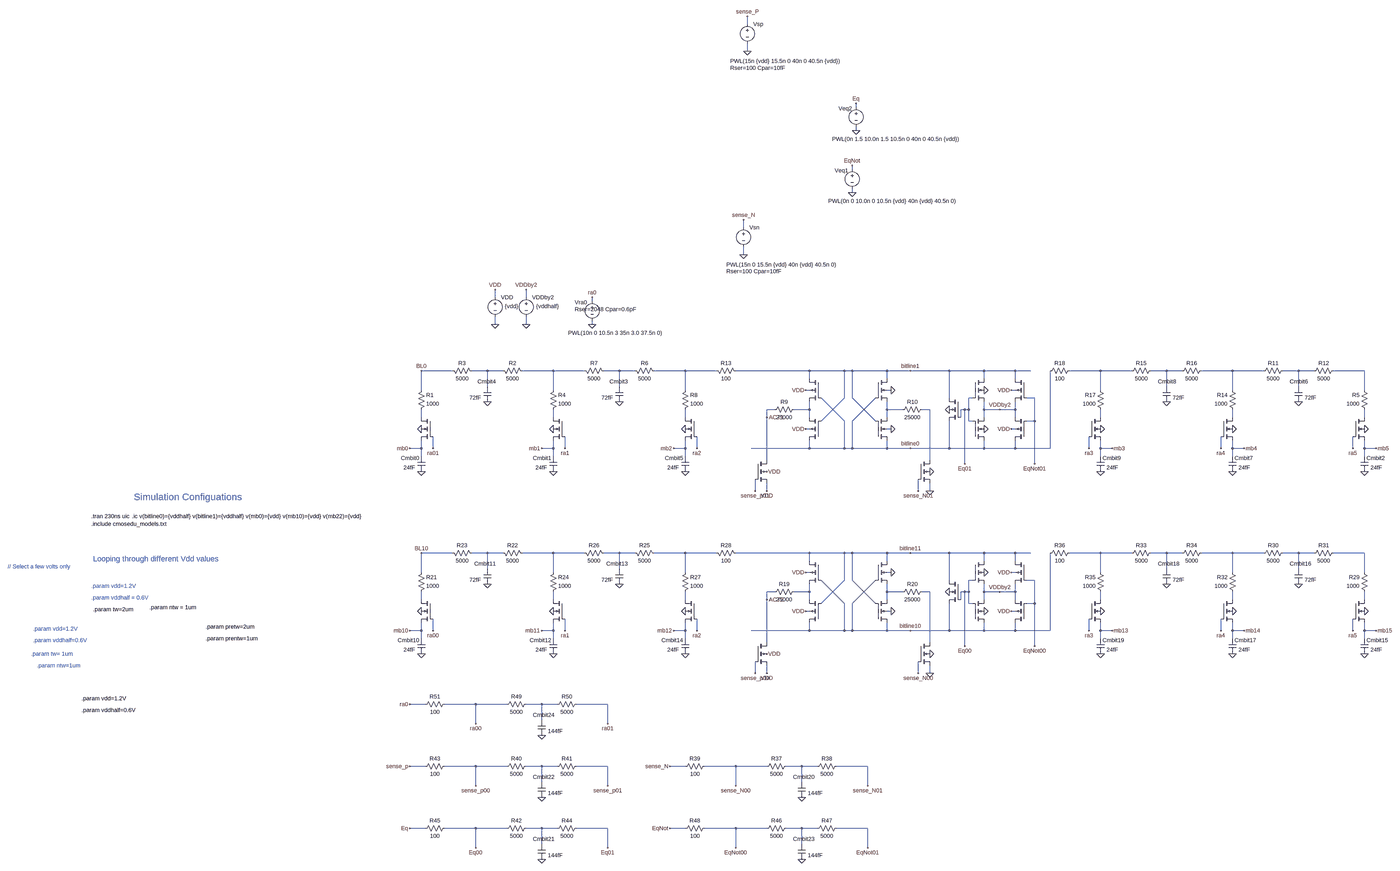
[diagram p0: schematic diva-dram_wordline.asc, whole sheet]
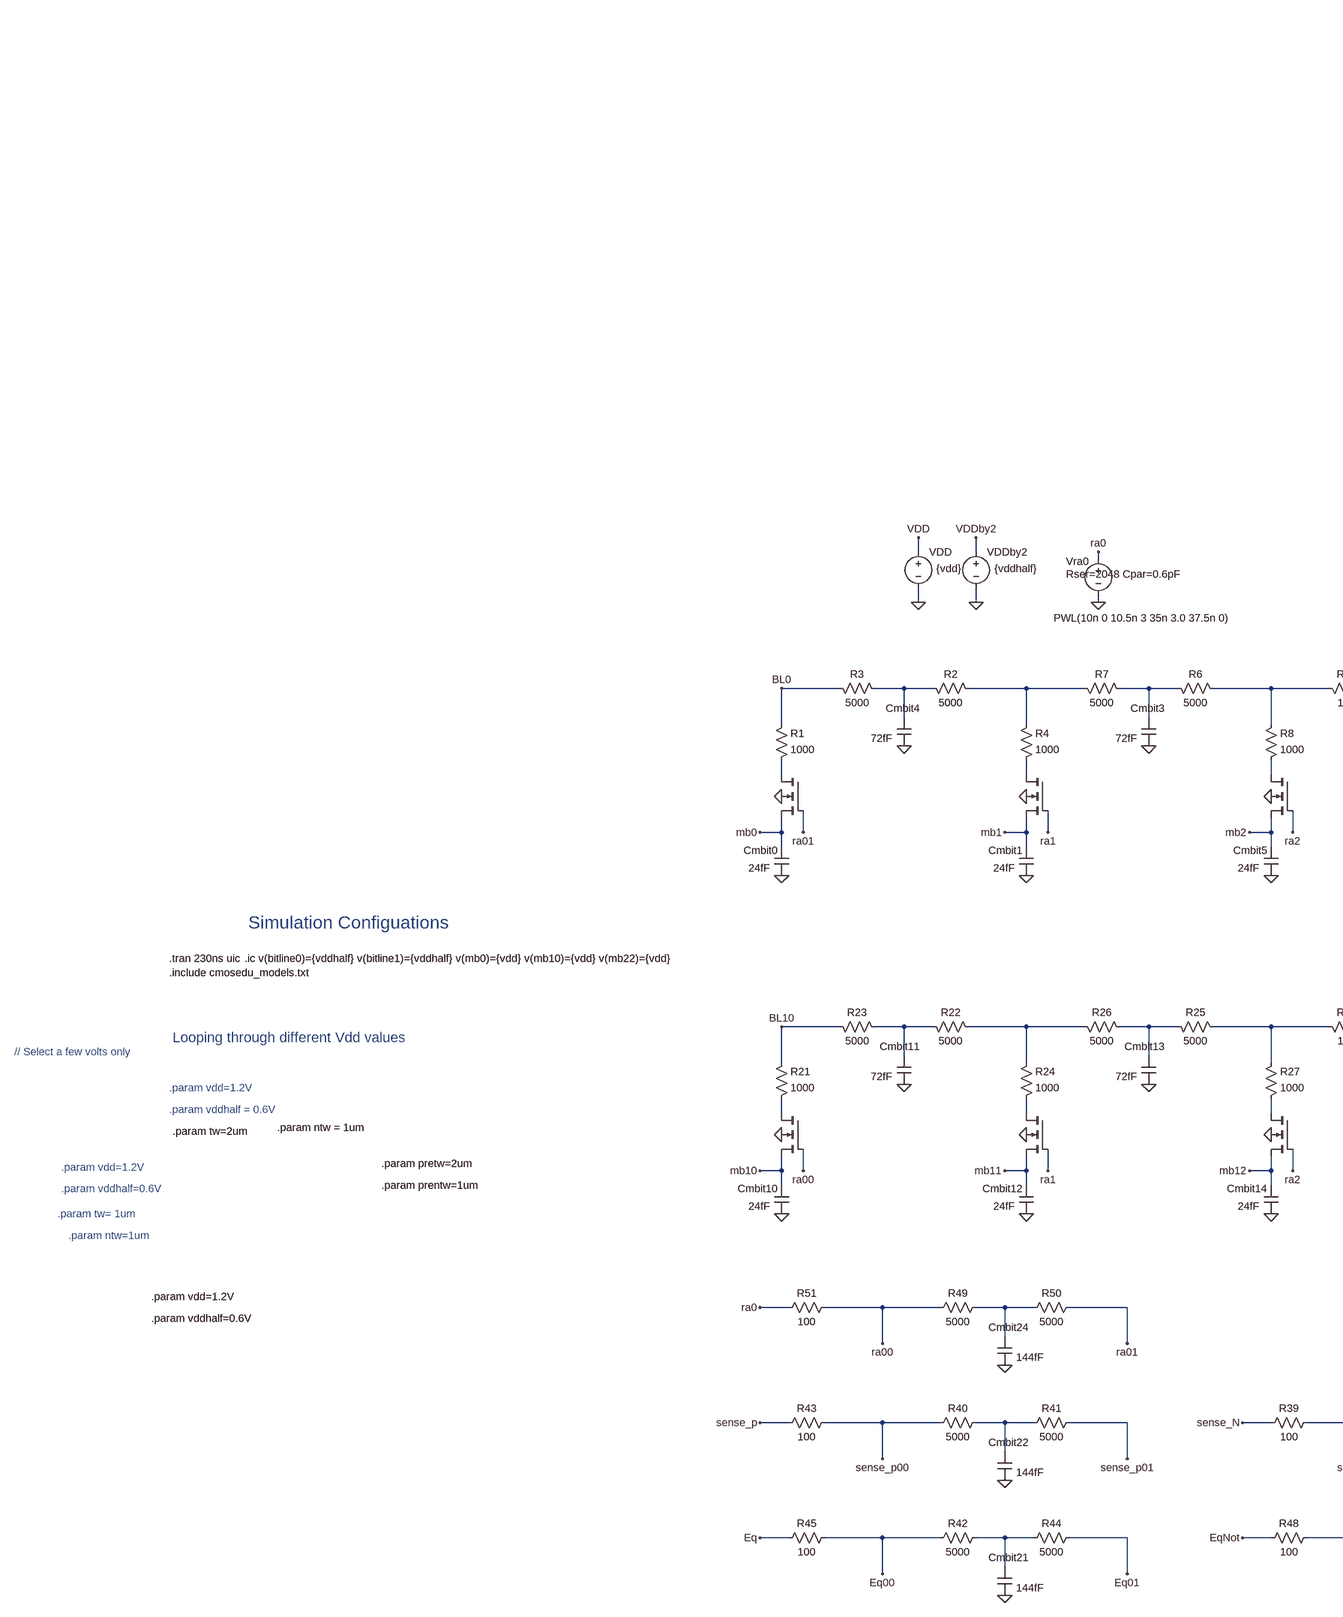
[diagram p1: schematic diva-dram_wordline.asc, part, row 1 of 1, column 1 of 2]
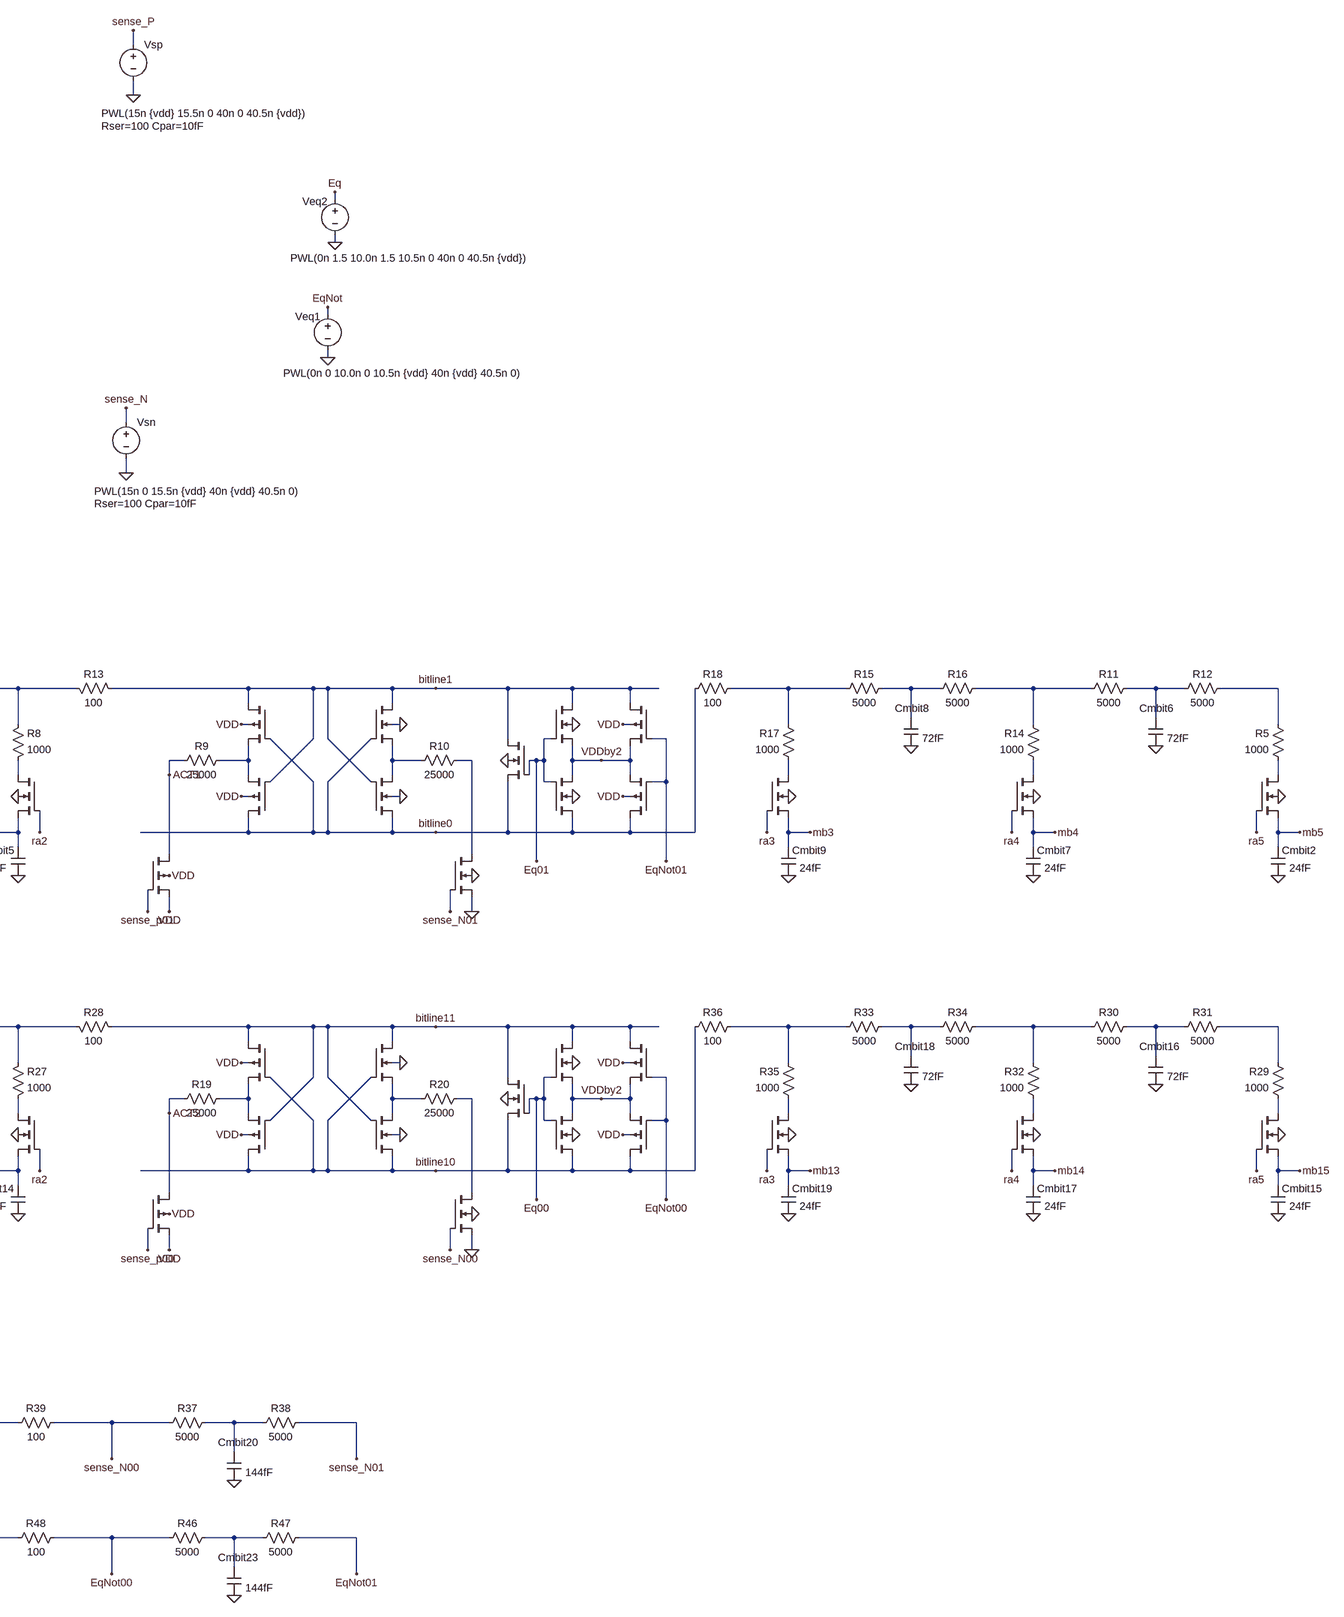
[diagram p2: schematic diva-dram_wordline.asc, part, row 1 of 1, column 2 of 2]
diva-dram_wordline.asc, the LTspice schematic file:
Version 4
SHEET 1 5584 2032
WIRE 2912 -2368 2912 -2400
WIRE 2912 -2256 2912 -2288
WIRE 3360 -2016 3360 -2032
WIRE 3360 -1920 3360 -1936
WIRE 3344 -1760 3344 -1776
WIRE 3344 -1664 3344 -1680
WIRE 2896 -1520 2896 -1552
WIRE 2896 -1408 2896 -1440
WIRE 1872 -1232 1872 -1264
WIRE 2000 -1232 2000 -1264
WIRE 2272 -1216 2272 -1232
WIRE 1872 -1120 1872 -1152
WIRE 2000 -1120 2000 -1152
WIRE 2272 -1120 2272 -1136
WIRE 1696 -112 1568 -112
WIRE 1840 -112 1776 -112
WIRE 1904 -112 1840 -112
WIRE 2112 -112 1984 -112
WIRE 2240 -112 2112 -112
WIRE 2384 -112 2320 -112
WIRE 2448 -112 2384 -112
WIRE 2656 -112 2528 -112
WIRE 2784 -112 2656 -112
WIRE 3168 -112 2864 -112
WIRE 3312 -112 3168 -112
WIRE 3344 -112 3312 -112
WIRE 3488 -112 3344 -112
WIRE 3584 -112 3488 -112
WIRE 3744 -112 3584 -112
WIRE 3888 -112 3744 -112
WIRE 4016 -112 3888 -112
WIRE 4080 -112 4016 -112
WIRE 4368 -112 4240 -112
WIRE 4496 -112 4368 -112
WIRE 4640 -112 4576 -112
WIRE 4704 -112 4640 -112
WIRE 4912 -112 4784 -112
WIRE 5040 -112 4912 -112
WIRE 5184 -112 5120 -112
WIRE 5248 -112 5184 -112
WIRE 5456 -112 5328 -112
WIRE 3168 -80 3168 -112
WIRE 3488 -80 3488 -112
WIRE 3888 -80 3888 -112
WIRE 4016 -80 4016 -112
WIRE 1840 -48 1840 -112
WIRE 2384 -48 2384 -112
WIRE 4640 -48 4640 -112
WIRE 5184 -48 5184 -112
WIRE 1568 -32 1568 -112
WIRE 2112 -32 2112 -112
WIRE 2656 -32 2656 -112
WIRE 3168 -32 3152 -32
WIRE 3504 -32 3488 -32
WIRE 4016 -32 4000 -32
WIRE 4368 -32 4368 -112
WIRE 4912 -32 4912 -112
WIRE 5456 -32 5456 -112
WIRE 3312 0 3312 -112
WIRE 3344 0 3344 -112
WIRE 3744 0 3744 -112
WIRE 3840 0 3824 0
WIRE 4096 0 4064 0
WIRE 3024 48 2992 48
WIRE 3168 48 3168 16
WIRE 3168 48 3104 48
WIRE 3488 48 3488 16
WIRE 3552 48 3488 48
WIRE 3664 48 3632 48
WIRE 3808 48 3792 48
WIRE 3824 48 3824 0
WIRE 3824 48 3808 48
WIRE 3888 48 3888 16
WIRE 3952 48 3888 48
WIRE 4016 48 4016 16
WIRE 4016 48 3952 48
WIRE 1568 80 1568 48
WIRE 2112 80 2112 48
WIRE 2656 80 2656 48
WIRE 2992 80 2992 48
WIRE 3168 80 3168 48
WIRE 3488 80 3488 48
WIRE 3792 80 3792 48
WIRE 3888 80 3888 48
WIRE 4016 80 4016 48
WIRE 4368 80 4368 48
WIRE 4912 80 4912 48
WIRE 5456 80 5456 48
WIRE 3216 96 3312 0
WIRE 3312 96 3216 0
WIRE 3344 96 3440 0
WIRE 3440 96 3344 0
WIRE 3824 96 3824 48
WIRE 3840 96 3824 96
WIRE 4096 96 4096 0
WIRE 4096 96 4064 96
WIRE 3168 128 3152 128
WIRE 3504 128 3488 128
WIRE 4016 128 4000 128
WIRE 1568 208 1568 176
WIRE 1568 208 1520 208
WIRE 1616 208 1616 160
WIRE 2112 208 2112 176
WIRE 2112 208 2064 208
WIRE 2160 208 2160 160
WIRE 2656 208 2656 176
WIRE 2656 208 2608 208
WIRE 2704 208 2704 160
WIRE 3168 208 3168 176
WIRE 3168 208 2928 208
WIRE 3312 208 3312 96
WIRE 3312 208 3168 208
WIRE 3344 208 3344 96
WIRE 3344 208 3312 208
WIRE 3488 208 3488 176
WIRE 3488 208 3344 208
WIRE 3584 208 3488 208
WIRE 3744 208 3744 96
WIRE 3744 208 3584 208
WIRE 3888 208 3888 176
WIRE 3888 208 3744 208
WIRE 4016 208 4016 176
WIRE 4016 208 3888 208
WIRE 4160 208 4160 -112
WIRE 4160 208 4016 208
WIRE 4320 208 4320 160
WIRE 4368 208 4368 176
WIRE 4416 208 4368 208
WIRE 4864 208 4864 160
WIRE 4912 208 4912 176
WIRE 4960 208 4912 208
WIRE 5408 208 5408 160
WIRE 5456 208 5456 176
WIRE 5504 208 5456 208
WIRE 1568 240 1568 208
WIRE 2112 240 2112 208
WIRE 2656 240 2656 208
WIRE 4368 240 4368 208
WIRE 4912 240 4912 208
WIRE 5456 240 5456 208
WIRE 2992 256 2992 80
WIRE 3664 256 3664 48
WIRE 3808 272 3808 48
WIRE 4096 272 4096 96
WIRE 2944 384 2944 336
WIRE 2992 384 2992 352
WIRE 3616 384 3616 336
WIRE 3664 384 3664 352
WIRE 1696 640 1568 640
WIRE 1840 640 1776 640
WIRE 1904 640 1840 640
WIRE 2112 640 1984 640
WIRE 2240 640 2112 640
WIRE 2384 640 2320 640
WIRE 2448 640 2384 640
WIRE 2656 640 2528 640
WIRE 2784 640 2656 640
WIRE 3168 640 2864 640
WIRE 3312 640 3168 640
WIRE 3344 640 3312 640
WIRE 3488 640 3344 640
WIRE 3584 640 3488 640
WIRE 3744 640 3584 640
WIRE 3888 640 3744 640
WIRE 4016 640 3888 640
WIRE 4080 640 4016 640
WIRE 4368 640 4240 640
WIRE 4496 640 4368 640
WIRE 4640 640 4576 640
WIRE 4704 640 4640 640
WIRE 4912 640 4784 640
WIRE 5040 640 4912 640
WIRE 5184 640 5120 640
WIRE 5248 640 5184 640
WIRE 5456 640 5328 640
WIRE 3168 672 3168 640
WIRE 3488 672 3488 640
WIRE 3888 672 3888 640
WIRE 4016 672 4016 640
WIRE 1840 704 1840 640
WIRE 2384 704 2384 640
WIRE 4640 704 4640 640
WIRE 5184 704 5184 640
WIRE 1568 720 1568 640
WIRE 2112 720 2112 640
WIRE 2656 720 2656 640
WIRE 3168 720 3152 720
WIRE 3504 720 3488 720
WIRE 4016 720 4000 720
WIRE 4368 720 4368 640
WIRE 4912 720 4912 640
WIRE 5456 720 5456 640
WIRE 3312 752 3312 640
WIRE 3344 752 3344 640
WIRE 3744 752 3744 640
WIRE 3840 752 3824 752
WIRE 4096 752 4064 752
WIRE 3024 800 2992 800
WIRE 3168 800 3168 768
WIRE 3168 800 3104 800
WIRE 3488 800 3488 768
WIRE 3552 800 3488 800
WIRE 3664 800 3632 800
WIRE 3808 800 3792 800
WIRE 3824 800 3824 752
WIRE 3824 800 3808 800
WIRE 3888 800 3888 768
WIRE 3952 800 3888 800
WIRE 4016 800 4016 768
WIRE 4016 800 3952 800
WIRE 1568 832 1568 800
WIRE 2112 832 2112 800
WIRE 2656 832 2656 800
WIRE 2992 832 2992 800
WIRE 3168 832 3168 800
WIRE 3488 832 3488 800
WIRE 3792 832 3792 800
WIRE 3888 832 3888 800
WIRE 4016 832 4016 800
WIRE 4368 832 4368 800
WIRE 4912 832 4912 800
WIRE 5456 832 5456 800
WIRE 3216 848 3312 752
WIRE 3312 848 3216 752
WIRE 3344 848 3440 752
WIRE 3440 848 3344 752
WIRE 3824 848 3824 800
WIRE 3840 848 3824 848
WIRE 4096 848 4096 752
WIRE 4096 848 4064 848
WIRE 3168 880 3152 880
WIRE 3504 880 3488 880
WIRE 4016 880 4000 880
WIRE 1568 960 1568 928
WIRE 1568 960 1520 960
WIRE 1616 960 1616 912
WIRE 2112 960 2112 928
WIRE 2112 960 2064 960
WIRE 2160 960 2160 912
WIRE 2656 960 2656 928
WIRE 2656 960 2608 960
WIRE 2704 960 2704 912
WIRE 3168 960 3168 928
WIRE 3168 960 2928 960
WIRE 3312 960 3312 848
WIRE 3312 960 3168 960
WIRE 3344 960 3344 848
WIRE 3344 960 3312 960
WIRE 3488 960 3488 928
WIRE 3488 960 3344 960
WIRE 3584 960 3488 960
WIRE 3744 960 3744 848
WIRE 3744 960 3584 960
WIRE 3888 960 3888 928
WIRE 3888 960 3744 960
WIRE 4016 960 4016 928
WIRE 4016 960 3888 960
WIRE 4160 960 4160 640
WIRE 4160 960 4016 960
WIRE 4320 960 4320 912
WIRE 4368 960 4368 928
WIRE 4416 960 4368 960
WIRE 4864 960 4864 912
WIRE 4912 960 4912 928
WIRE 4960 960 4912 960
WIRE 5408 960 5408 912
WIRE 5456 960 5456 928
WIRE 5504 960 5456 960
WIRE 1568 992 1568 960
WIRE 2112 992 2112 960
WIRE 2656 992 2656 960
WIRE 4368 992 4368 960
WIRE 4912 992 4912 960
WIRE 5456 992 5456 960
WIRE 2992 1008 2992 832
WIRE 3664 1008 3664 800
WIRE 3808 1024 3808 800
WIRE 4096 1024 4096 848
WIRE 2944 1136 2944 1088
WIRE 2992 1136 2992 1104
WIRE 3616 1136 3616 1088
WIRE 3664 1136 3664 1104
WIRE 1584 1264 1520 1264
WIRE 1792 1264 1664 1264
WIRE 1920 1264 1792 1264
WIRE 2064 1264 2000 1264
WIRE 2128 1264 2064 1264
WIRE 2336 1264 2208 1264
WIRE 2064 1328 2064 1264
WIRE 1792 1344 1792 1264
WIRE 2336 1344 2336 1264
WIRE 1584 1520 1520 1520
WIRE 1792 1520 1664 1520
WIRE 1920 1520 1792 1520
WIRE 2064 1520 2000 1520
WIRE 2128 1520 2064 1520
WIRE 2336 1520 2208 1520
WIRE 2656 1520 2592 1520
WIRE 2864 1520 2736 1520
WIRE 2992 1520 2864 1520
WIRE 3136 1520 3072 1520
WIRE 3200 1520 3136 1520
WIRE 3408 1520 3280 1520
WIRE 2064 1584 2064 1520
WIRE 3136 1584 3136 1520
WIRE 1792 1600 1792 1520
WIRE 2336 1600 2336 1520
WIRE 2864 1600 2864 1520
WIRE 3408 1600 3408 1520
WIRE 1584 1776 1520 1776
WIRE 1792 1776 1664 1776
WIRE 1920 1776 1792 1776
WIRE 2064 1776 2000 1776
WIRE 2128 1776 2064 1776
WIRE 2336 1776 2208 1776
WIRE 2656 1776 2592 1776
WIRE 2864 1776 2736 1776
WIRE 2992 1776 2864 1776
WIRE 3136 1776 3072 1776
WIRE 3200 1776 3136 1776
WIRE 3408 1776 3280 1776
WIRE 2064 1840 2064 1776
WIRE 3136 1840 3136 1776
WIRE 1792 1856 1792 1776
WIRE 2336 1856 2336 1776
WIRE 2864 1856 2864 1776
WIRE 3408 1856 3408 1776
FLAG 1872 -1120 0
FLAG 1872 -1264 VDD
FLAG 2000 -1120 0
FLAG 2000 -1264 VDDby2
FLAG 2912 -2256 0
FLAG 2912 -2400 sense_P
FLAG 2272 -1120 0
FLAG 2272 -1232 ra0
FLAG 2896 -1408 0
FLAG 2896 -1552 sense_N
FLAG 3344 -1664 0
FLAG 3344 -1776 EqNot
FLAG 3360 -1920 0
FLAG 3360 -2032 Eq
FLAG 3152 -32 VDD
FLAG 2992 80 ACT1
FLAG 3152 128 VDD
FLAG 3504 128 0
FLAG 3504 -32 0
FLAG 3744 48 0
FLAG 3888 128 0
FLAG 3888 -32 0
FLAG 3808 272 Eq01
FLAG 3952 48 VDDby2
FLAG 3584 208 bitline0
FLAG 3584 -112 bitline1
FLAG 4096 272 EqNot01
FLAG 4000 128 VDD
FLAG 4000 -32 VDD
FLAG 3664 304 0
FLAG 3616 384 sense_N01
FLAG 3664 384 0
FLAG 2992 304 VDD
FLAG 2992 384 VDD
FLAG 2944 384 sense_p01
FLAG 1568 128 0
FLAG 1568 304 0
FLAG 1520 208 mb0
FLAG 1616 208 ra01
FLAG 1840 16 0
FLAG 2112 128 0
FLAG 2112 304 0
FLAG 2064 208 mb1
FLAG 2160 208 ra1
FLAG 2384 16 0
FLAG 2656 128 0
FLAG 2656 304 0
FLAG 2608 208 mb2
FLAG 2704 208 ra2
FLAG 5456 128 0
FLAG 5456 304 0
FLAG 5504 208 mb5
FLAG 5408 208 ra5
FLAG 5184 16 0
FLAG 4912 128 0
FLAG 4912 304 0
FLAG 4960 208 mb4
FLAG 4864 208 ra4
FLAG 4640 16 0
FLAG 4368 128 0
FLAG 4368 304 0
FLAG 4416 208 mb3
FLAG 4320 208 ra3
FLAG 3152 720 VDD
FLAG 2992 832 ACT2
FLAG 3152 880 VDD
FLAG 3504 880 0
FLAG 3504 720 0
FLAG 3744 800 0
FLAG 3888 880 0
FLAG 3888 720 0
FLAG 3808 1024 Eq00
FLAG 3952 800 VDDby2
FLAG 3584 960 bitline10
FLAG 3584 640 bitline11
FLAG 4096 1024 EqNot00
FLAG 4000 880 VDD
FLAG 4000 720 VDD
FLAG 3664 1056 0
FLAG 3616 1136 sense_N00
FLAG 3664 1136 0
FLAG 2992 1056 VDD
FLAG 2992 1136 VDD
FLAG 2944 1136 sense_p00
FLAG 1568 880 0
FLAG 1568 1056 0
FLAG 1520 960 mb10
FLAG 1616 960 ra00
FLAG 1840 768 0
FLAG 2112 880 0
FLAG 2112 1056 0
FLAG 2064 960 mb11
FLAG 2160 960 ra1
FLAG 2384 768 0
FLAG 2656 880 0
FLAG 2656 1056 0
FLAG 2608 960 mb12
FLAG 2704 960 ra2
FLAG 5456 880 0
FLAG 5456 1056 0
FLAG 5504 960 mb15
FLAG 5408 960 ra5
FLAG 5184 768 0
FLAG 4912 880 0
FLAG 4912 1056 0
FLAG 4960 960 mb14
FLAG 4864 960 ra4
FLAG 4640 768 0
FLAG 4368 880 0
FLAG 4368 1056 0
FLAG 4416 960 mb13
FLAG 4320 960 ra3
FLAG 1568 -112 BL0
FLAG 1568 640 BL10
FLAG 2064 1648 0
FLAG 3136 1648 0
FLAG 2064 1904 0
FLAG 3136 1904 0
FLAG 2064 1392 0
FLAG 1520 1264 ra0
FLAG 1792 1344 ra00
FLAG 2336 1344 ra01
FLAG 1520 1520 sense_p
FLAG 2592 1520 sense_N
FLAG 1520 1776 Eq
FLAG 2592 1776 EqNot
FLAG 1792 1600 sense_p00
FLAG 2336 1600 sense_p01
FLAG 1792 1856 Eq00
FLAG 2336 1856 Eq01
FLAG 2864 1600 sense_N00
FLAG 3408 1600 sense_N01
FLAG 2864 1856 EqNot00
FLAG 3408 1856 EqNot01
SYMBOL voltage 1872 -1248 R0
WINDOW 123 0 0 Left 2
WINDOW 39 0 0 Left 2
WINDOW 3 40 53 Left 2
SYMATTR Value {vdd}
SYMATTR InstName VDD
SYMBOL voltage 2000 -1248 R0
WINDOW 123 0 0 Left 2
WINDOW 39 0 0 Left 2
WINDOW 3 41 53 Left 2
SYMATTR Value {vddhalf}
SYMATTR InstName VDDby2
SYMBOL voltage 2912 -2384 R0
WINDOW 123 0 0 Left 2
WINDOW 39 -71 197 Left 2
WINDOW 3 -71 169 Left 2
SYMATTR SpiceLine Rser=100 Cpar=10fF
SYMATTR Value PWL(15n {vdd} 15.5n 0 40n 0 40.5n {vdd})
SYMATTR InstName Vsp
SYMBOL voltage 2272 -1232 R0
WINDOW 0 -72 21 Left 2
WINDOW 3 -99 147 Left 2
WINDOW 123 0 0 Left 2
WINDOW 39 -72 49 Left 2
SYMATTR InstName Vra0
SYMATTR Value PWL(10n 0 10.5n 3 35n 3.0 37.5n 0)
SYMATTR SpiceLine Rser=2048 Cpar=0.6pF
SYMBOL voltage 2896 -1536 R0
WINDOW 123 0 0 Left 2
WINDOW 39 -71 197 Left 2
WINDOW 3 -71 169 Left 2
SYMATTR SpiceLine Rser=100 Cpar=10fF
SYMATTR Value PWL(15n 0 15.5n {vdd} 40n {vdd} 40.5n 0)
SYMATTR InstName Vsn
SYMBOL voltage 3344 -1776 R0
WINDOW 0 -72 21 Left 2
WINDOW 3 -99 147 Left 2
WINDOW 123 0 0 Left 2
WINDOW 39 0 0 Left 2
SYMATTR InstName Veq1
SYMATTR Value PWL(0n 0 10.0n 0 10.5n {vdd} 40n {vdd} 40.5n 0)
SYMBOL voltage 3360 -2032 R0
WINDOW 0 -72 21 Left 2
WINDOW 3 -99 147 Left 2
WINDOW 123 0 0 Left 2
WINDOW 39 0 0 Left 2
SYMATTR InstName Veq2
SYMATTR Value PWL(0n 1.5 10.0n 1.5 10.5n 0 40n 0 40.5n {vdd})
SYMBOL pmos4 3216 -80 M0
WINDOW 0 56 32 Invisible 2
WINDOW 3 56 72 Invisible 2
SYMATTR InstName M15
SYMATTR Value pmos45hp
SYMATTR Value2 l=0.16um w={tw}
SYMBOL res 3120 32 R90
WINDOW 0 0 56 VBottom 2
WINDOW 3 32 56 VTop 2
SYMATTR InstName R9
SYMATTR Value 25000
SYMBOL pmos4 3216 176 R180
WINDOW 0 56 32 Invisible 2
WINDOW 3 56 72 Invisible 2
SYMATTR InstName M16
SYMATTR Value pmos45hp
SYMATTR Value2 l=0.16um w={tw}
SYMBOL nmos4 3440 -80 R0
WINDOW 0 104 24 Invisible 2
WINDOW 3 179 41 Invisible 2
SYMATTR InstName M17
SYMATTR Value nmos45hp
SYMATTR Value2 l=0.16um w={ntw}
SYMBOL nmos4 3440 176 M180
WINDOW 0 104 24 Invisible 2
WINDOW 3 179 41 Invisible 2
SYMATTR InstName M18
SYMATTR Value nmos45hp
SYMATTR Value2 l=0.16um w={ntw}
SYMBOL res 3648 32 R90
WINDOW 0 0 56 VBottom 2
WINDOW 3 32 56 VTop 2
SYMATTR InstName R10
SYMATTR Value 25000
SYMBOL nmos4 3792 0 M0
WINDOW 0 104 24 Invisible 2
WINDOW 3 179 41 Invisible 2
SYMATTR InstName M19
SYMATTR Value nmos45hp
SYMATTR Value2 l=0.5um w={prentw}
SYMBOL nmos4 3840 176 M180
WINDOW 0 104 24 Invisible 2
WINDOW 3 179 41 Invisible 2
SYMATTR InstName M20
SYMATTR Value nmos45hp
SYMATTR Value2 l=0.5um w={prentw}
SYMBOL nmos4 3840 -80 R0
WINDOW 0 104 24 Invisible 2
WINDOW 3 179 41 Invisible 2
SYMATTR InstName M21
SYMATTR Value nmos45hp
SYMATTR Value2 l=0.5um w={prentw}
SYMBOL pmos4 4064 176 R180
WINDOW 0 56 32 Invisible 2
WINDOW 3 56 72 Invisible 2
SYMATTR InstName M22
SYMATTR Value pmos45hp
SYMATTR Value2 l=0.5um w={pretw}
SYMBOL pmos4 4064 -80 M0
WINDOW 0 56 32 Invisible 2
WINDOW 3 56 72 Invisible 2
SYMATTR InstName M23
SYMATTR Value pmos45hp
SYMATTR Value2 l=0.5um w={pretw}
SYMBOL nmos4 3616 256 R0
WINDOW 0 104 24 Invisible 2
WINDOW 3 179 41 Invisible 2
SYMATTR InstName M24
SYMATTR Value nmos45lp
SYMATTR Value2 l=0.27um w=0.22um
SYMBOL pmos4 2944 256 R0
WINDOW 0 56 32 Invisible 2
WINDOW 3 56 72 Invisible 2
SYMATTR InstName M25
SYMATTR Value pmos45lp
SYMATTR Value2 l=0.27um w=0.22um
SYMBOL nmos4 1616 80 M0
WINDOW 0 104 24 Invisible 2
WINDOW 3 179 41 Invisible 2
SYMATTR InstName M1
SYMATTR Value nmos45lp
SYMATTR Value2 l=0.085um w=0.055um
SYMBOL cap 1584 240 M0
WINDOW 3 41 47 Left 2
SYMATTR Value 24fF
SYMATTR InstName Cmbit0
SYMBOL res 1552 64 M180
WINDOW 0 36 76 Left 2
WINDOW 3 36 40 Left 2
SYMATTR InstName R1
SYMATTR Value 1000
SYMBOL res 1888 -128 M90
WINDOW 3 32 56 VTop 2
WINDOW 0 0 56 VBottom 2
SYMATTR Value 5000
SYMATTR InstName R2
SYMBOL res 1680 -128 M90
WINDOW 3 32 56 VTop 2
WINDOW 0 0 56 VBottom 2
SYMATTR Value 5000
SYMATTR InstName R3
SYMBOL cap 1856 -48 M0
WINDOW 3 41 47 Left 2
WINDOW 0 -20 -20 Left 2
SYMATTR Value 72fF
SYMATTR InstName Cmbit4
SYMBOL nmos4 2160 80 M0
WINDOW 0 104 24 Invisible 2
WINDOW 3 179 41 Invisible 2
SYMATTR InstName M2
SYMATTR Value nmos45lp
SYMATTR Value2 l=0.085um w=0.055um
SYMBOL cap 2128 240 M0
WINDOW 3 41 47 Left 2
SYMATTR Value 24fF
SYMATTR InstName Cmbit1
SYMBOL res 2096 64 M180
WINDOW 0 36 76 Left 2
WINDOW 3 36 40 Left 2
SYMATTR InstName R4
SYMATTR Value 1000
SYMBOL res 2432 -128 M90
WINDOW 3 32 56 VTop 2
WINDOW 0 0 56 VBottom 2
SYMATTR Value 5000
SYMATTR InstName R6
SYMBOL res 2224 -128 M90
WINDOW 3 32 56 VTop 2
WINDOW 0 0 56 VBottom 2
SYMATTR Value 5000
SYMATTR InstName R7
SYMBOL cap 2400 -48 M0
WINDOW 3 41 47 Left 2
WINDOW 0 -20 -20 Left 2
SYMATTR Value 72fF
SYMATTR InstName Cmbit3
SYMBOL nmos4 2704 80 M0
WINDOW 0 104 24 Invisible 2
WINDOW 3 179 41 Invisible 2
SYMATTR InstName M3
SYMATTR Value nmos45lp
SYMATTR Value2 l=0.085um w=0.055um
SYMBOL cap 2672 240 M0
WINDOW 3 41 47 Left 2
SYMATTR Value 24fF
SYMATTR InstName Cmbit5
SYMBOL res 2640 64 M180
WINDOW 0 36 76 Left 2
WINDOW 3 36 40 Left 2
SYMATTR InstName R8
SYMATTR Value 1000
SYMBOL res 2768 -128 M90
WINDOW 3 32 56 VTop 2
WINDOW 0 0 56 VBottom 2
SYMATTR Value 100
SYMATTR InstName R13
SYMBOL nmos4 5408 80 R0
WINDOW 0 104 24 Invisible 2
WINDOW 3 179 41 Invisible 2
SYMATTR InstName M4
SYMATTR Value nmos45lp
SYMATTR Value2 l=0.085um w=0.055um
SYMBOL cap 5440 240 R0
WINDOW 3 41 47 Left 2
SYMATTR Value 24fF
SYMATTR InstName Cmbit2
SYMBOL res 5472 64 R180
WINDOW 0 36 76 Left 2
WINDOW 3 36 40 Left 2
SYMATTR InstName R5
SYMATTR Value 1000
SYMBOL res 5136 -128 R90
WINDOW 3 32 56 VTop 2
WINDOW 0 0 56 VBottom 2
SYMATTR Value 5000
SYMATTR InstName R11
SYMBOL res 5344 -128 R90
WINDOW 3 32 56 VTop 2
WINDOW 0 0 56 VBottom 2
SYMATTR Value 5000
SYMATTR InstName R12
SYMBOL cap 5168 -48 R0
WINDOW 3 41 47 Left 2
WINDOW 0 -20 -20 Left 2
SYMATTR Value 72fF
SYMATTR InstName Cmbit6
SYMBOL nmos4 4864 80 R0
WINDOW 0 104 24 Invisible 2
WINDOW 3 179 41 Invisible 2
SYMATTR InstName M5
SYMATTR Value nmos45lp
SYMATTR Value2 l=0.085um w=0.055um
SYMBOL cap 4896 240 R0
WINDOW 3 41 47 Left 2
SYMATTR Value 24fF
SYMATTR InstName Cmbit7
SYMBOL res 4928 64 R180
WINDOW 0 36 76 Left 2
WINDOW 3 36 40 Left 2
SYMATTR InstName R14
SYMATTR Value 1000
SYMBOL res 4592 -128 R90
WINDOW 3 32 56 VTop 2
WINDOW 0 0 56 VBottom 2
SYMATTR Value 5000
SYMATTR InstName R15
SYMBOL res 4800 -128 R90
WINDOW 3 32 56 VTop 2
WINDOW 0 0 56 VBottom 2
SYMATTR Value 5000
SYMATTR InstName R16
SYMBOL cap 4624 -48 R0
WINDOW 3 41 47 Left 2
WINDOW 0 -20 -20 Left 2
SYMATTR Value 72fF
SYMATTR InstName Cmbit8
SYMBOL nmos4 4320 80 R0
WINDOW 0 104 24 Invisible 2
WINDOW 3 179 41 Invisible 2
SYMATTR InstName M6
SYMATTR Value nmos45lp
SYMATTR Value2 l=0.085um w=0.055um
SYMBOL cap 4352 240 R0
WINDOW 3 41 47 Left 2
SYMATTR Value 24fF
SYMATTR InstName Cmbit9
SYMBOL res 4384 64 R180
WINDOW 0 36 76 Left 2
WINDOW 3 36 40 Left 2
SYMATTR InstName R17
SYMATTR Value 1000
SYMBOL res 4256 -128 R90
WINDOW 3 32 56 VTop 2
WINDOW 0 0 56 VBottom 2
SYMATTR Value 100
SYMATTR InstName R18
SYMBOL pmos4 3216 672 M0
WINDOW 0 56 32 Invisible 2
WINDOW 3 56 72 Invisible 2
SYMATTR InstName M7
SYMATTR Value pmos45hp
SYMATTR Value2 l=0.16um w={tw}
SYMBOL res 3120 784 R90
WINDOW 0 0 56 VBottom 2
WINDOW 3 32 56 VTop 2
SYMATTR InstName R19
SYMATTR Value 25000
SYMBOL pmos4 3216 928 R180
WINDOW 0 56 32 Invisible 2
WINDOW 3 56 72 Invisible 2
SYMATTR InstName M8
SYMATTR Value pmos45hp
SYMATTR Value2 l=0.16um w={tw}
SYMBOL nmos4 3440 672 R0
WINDOW 0 104 24 Invisible 2
WINDOW 3 179 41 Invisible 2
SYMATTR InstName M9
SYMATTR Value nmos45hp
SYMATTR Value2 l=0.16um w={ntw}
SYMBOL nmos4 3440 928 M180
WINDOW 0 104 24 Invisible 2
WINDOW 3 179 41 Invisible 2
SYMATTR InstName M10
SYMATTR Value nmos45hp
SYMATTR Value2 l=0.16um w={ntw}
SYMBOL res 3648 784 R90
WINDOW 0 0 56 VBottom 2
WINDOW 3 32 56 VTop 2
SYMATTR InstName R20
SYMATTR Value 25000
SYMBOL nmos4 3792 752 M0
WINDOW 0 104 24 Invisible 2
WINDOW 3 179 41 Invisible 2
SYMATTR InstName M11
SYMATTR Value nmos45hp
SYMATTR Value2 l=0.5um w={prentw}
SYMBOL nmos4 3840 928 M180
WINDOW 0 104 24 Invisible 2
WINDOW 3 179 41 Invisible 2
SYMATTR InstName M12
SYMATTR Value nmos45hp
SYMATTR Value2 l=0.5um w={prentw}
SYMBOL nmos4 3840 672 R0
WINDOW 0 104 24 Invisible 2
WINDOW 3 179 41 Invisible 2
SYMATTR InstName M13
SYMATTR Value nmos45hp
SYMATTR Value2 l=0.5um w={prentw}
SYMBOL pmos4 4064 928 R180
WINDOW 0 56 32 Invisible 2
WINDOW 3 56 72 Invisible 2
SYMATTR InstName M14
SYMATTR Value pmos45hp
SYMATTR Value2 l=0.5um w={pretw}
SYMBOL pmos4 4064 672 M0
WINDOW 0 56 32 Invisible 2
WINDOW 3 56 72 Invisible 2
SYMATTR InstName M26
SYMATTR Value pmos45hp
SYMATTR Value2 l=0.5um w={pretw}
SYMBOL nmos4 3616 1008 R0
WINDOW 0 104 24 Invisible 2
WINDOW 3 179 41 Invisible 2
SYMATTR InstName M27
SYMATTR Value nmos45lp
SYMATTR Value2 l=0.27um w=0.22um
SYMBOL pmos4 2944 1008 R0
WINDOW 0 56 32 Invisible 2
WINDOW 3 56 72 Invisible 2
SYMATTR InstName M28
SYMATTR Value pmos45lp
SYMATTR Value2 l=0.27um w=0.22um
SYMBOL nmos4 1616 832 M0
WINDOW 0 104 24 Invisible 2
WINDOW 3 179 41 Invisible 2
SYMATTR InstName M29
SYMATTR Value nmos45lp
SYMATTR Value2 l=0.085um w=0.055um
SYMBOL cap 1584 992 M0
WINDOW 3 41 47 Left 2
SYMATTR Value 24fF
SYMATTR InstName Cmbit10
SYMBOL res 1552 816 M180
WINDOW 0 36 76 Left 2
WINDOW 3 36 40 Left 2
SYMATTR InstName R21
SYMATTR Value 1000
SYMBOL res 1888 624 M90
WINDOW 3 32 56 VTop 2
WINDOW 0 0 56 VBottom 2
SYMATTR Value 5000
SYMATTR InstName R22
SYMBOL res 1680 624 M90
WINDOW 3 32 56 VTop 2
WINDOW 0 0 56 VBottom 2
SYMATTR Value 5000
SYMATTR InstName R23
SYMBOL cap 1856 704 M0
WINDOW 3 41 47 Left 2
WINDOW 0 -20 -20 Left 2
SYMATTR Value 72fF
SYMATTR InstName Cmbit11
SYMBOL nmos4 2160 832 M0
WINDOW 0 104 24 Invisible 2
WINDOW 3 179 41 Invisible 2
SYMATTR InstName M30
SYMATTR Value nmos45lp
SYMATTR Value2 l=0.085um w=0.055um
SYMBOL cap 2128 992 M0
WINDOW 3 41 47 Left 2
SYMATTR Value 24fF
SYMATTR InstName Cmbit12
SYMBOL res 2096 816 M180
WINDOW 0 36 76 Left 2
WINDOW 3 36 40 Left 2
SYMATTR InstName R24
SYMATTR Value 1000
SYMBOL res 2432 624 M90
WINDOW 3 32 56 VTop 2
WINDOW 0 0 56 VBottom 2
SYMATTR Value 5000
SYMATTR InstName R25
SYMBOL res 2224 624 M90
WINDOW 3 32 56 VTop 2
WINDOW 0 0 56 VBottom 2
SYMATTR Value 5000
SYMATTR InstName R26
SYMBOL cap 2400 704 M0
WINDOW 3 41 47 Left 2
WINDOW 0 -20 -20 Left 2
SYMATTR Value 72fF
SYMATTR InstName Cmbit13
SYMBOL nmos4 2704 832 M0
WINDOW 0 104 24 Invisible 2
WINDOW 3 179 41 Invisible 2
SYMATTR InstName M31
SYMATTR Value nmos45lp
SYMATTR Value2 l=0.085um w=0.055um
SYMBOL cap 2672 992 M0
WINDOW 3 41 47 Left 2
SYMATTR Value 24fF
SYMATTR InstName Cmbit14
SYMBOL res 2640 816 M180
WINDOW 0 36 76 Left 2
WINDOW 3 36 40 Left 2
SYMATTR InstName R27
SYMATTR Value 1000
SYMBOL res 2768 624 M90
WINDOW 3 32 56 VTop 2
WINDOW 0 0 56 VBottom 2
SYMATTR Value 100
SYMATTR InstName R28
SYMBOL nmos4 5408 832 R0
WINDOW 0 104 24 Invisible 2
WINDOW 3 179 41 Invisible 2
SYMATTR InstName M32
SYMATTR Value nmos45lp
SYMATTR Value2 l=0.085um w=0.055um
SYMBOL cap 5440 992 R0
WINDOW 3 41 47 Left 2
SYMATTR Value 24fF
SYMATTR InstName Cmbit15
SYMBOL res 5472 816 R180
WINDOW 0 36 76 Left 2
WINDOW 3 36 40 Left 2
SYMATTR InstName R29
SYMATTR Value 1000
SYMBOL res 5136 624 R90
WINDOW 3 32 56 VTop 2
WINDOW 0 0 56 VBottom 2
SYMATTR Value 5000
SYMATTR InstName R30
SYMBOL res 5344 624 R90
WINDOW 3 32 56 VTop 2
WINDOW 0 0 56 VBottom 2
SYMATTR Value 5000
SYMATTR InstName R31
SYMBOL cap 5168 704 R0
WINDOW 3 41 47 Left 2
WINDOW 0 -20 -20 Left 2
SYMATTR Value 72fF
SYMATTR InstName Cmbit16
SYMBOL nmos4 4864 832 R0
WINDOW 0 104 24 Invisible 2
WINDOW 3 179 41 Invisible 2
SYMATTR InstName M33
SYMATTR Value nmos45lp
SYMATTR Value2 l=0.085um w=0.055um
SYMBOL cap 4896 992 R0
WINDOW 3 41 47 Left 2
SYMATTR Value 24fF
SYMATTR InstName Cmbit17
SYMBOL res 4928 816 R180
WINDOW 0 36 76 Left 2
WINDOW 3 36 40 Left 2
SYMATTR InstName R32
SYMATTR Value 1000
SYMBOL res 4592 624 R90
WINDOW 3 32 56 VTop 2
WINDOW 0 0 56 VBottom 2
SYMATTR Value 5000
SYMATTR InstName R33
SYMBOL res 4800 624 R90
WINDOW 3 32 56 VTop 2
WINDOW 0 0 56 VBottom 2
SYMATTR Value 5000
SYMATTR InstName R34
SYMBOL cap 4624 704 R0
WINDOW 3 41 47 Left 2
WINDOW 0 -20 -20 Left 2
SYMATTR Value 72fF
SYMATTR InstName Cmbit18
SYMBOL nmos4 4320 832 R0
WINDOW 0 104 24 Invisible 2
WINDOW 3 179 41 Invisible 2
SYMATTR InstName M34
SYMATTR Value nmos45lp
SYMATTR Value2 l=0.085um w=0.055um
SYMBOL cap 4352 992 R0
WINDOW 3 41 47 Left 2
SYMATTR Value 24fF
SYMATTR InstName Cmbit19
SYMBOL res 4384 816 R180
WINDOW 0 36 76 Left 2
WINDOW 3 36 40 Left 2
SYMATTR InstName R35
SYMATTR Value 1000
SYMBOL res 4256 624 R90
WINDOW 3 32 56 VTop 2
WINDOW 0 0 56 VBottom 2
SYMATTR Value 100
SYMATTR InstName R36
SYMBOL res 2016 1504 R90
WINDOW 3 32 56 VTop 2
WINDOW 0 0 56 VBottom 2
SYMATTR Value 5000
SYMATTR InstName R40
SYMBOL res 2224 1504 R90
WINDOW 3 32 56 VTop 2
WINDOW 0 0 56 VBottom 2
SYMATTR Value 5000
SYMATTR InstName R41
SYMBOL cap 2048 1584 R0
WINDOW 3 41 47 Left 2
WINDOW 0 -20 -20 Left 2
SYMATTR Value 144fF
SYMATTR InstName Cmbit22
SYMBOL res 1680 1504 R90
WINDOW 3 32 56 VTop 2
WINDOW 0 0 56 VBottom 2
SYMATTR Value 100
SYMATTR InstName R43
SYMBOL res 3088 1504 R90
WINDOW 3 32 56 VTop 2
WINDOW 0 0 56 VBottom 2
SYMATTR Value 5000
SYMATTR InstName R37
SYMBOL res 3296 1504 R90
WINDOW 3 32 56 VTop 2
WINDOW 0 0 56 VBottom 2
SYMATTR Value 5000
SYMATTR InstName R38
SYMBOL cap 3120 1584 R0
WINDOW 3 41 47 Left 2
WINDOW 0 -20 -20 Left 2
SYMATTR Value 144fF
SYMATTR InstName Cmbit20
SYMBOL res 2752 1504 R90
WINDOW 3 32 56 VTop 2
WINDOW 0 0 56 VBottom 2
SYMATTR Value 100
SYMATTR InstName R39
SYMBOL res 2016 1760 R90
WINDOW 3 32 56 VTop 2
WINDOW 0 0 56 VBottom 2
SYMATTR Value 5000
SYMATTR InstName R42
SYMBOL res 2224 1760 R90
WINDOW 3 32 56 VTop 2
WINDOW 0 0 56 VBottom 2
SYMATTR Value 5000
SYMATTR InstName R44
SYMBOL cap 2048 1840 R0
WINDOW 3 41 47 Left 2
WINDOW 0 -20 -20 Left 2
SYMATTR Value 144fF
SYMATTR InstName Cmbit21
SYMBOL res 1680 1760 R90
WINDOW 3 32 56 VTop 2
WINDOW 0 0 56 VBottom 2
SYMATTR Value 100
SYMATTR InstName R45
SYMBOL res 3088 1760 R90
WINDOW 3 32 56 VTop 2
WINDOW 0 0 56 VBottom 2
SYMATTR Value 5000
SYMATTR InstName R46
SYMBOL res 3296 1760 R90
WINDOW 3 32 56 VTop 2
WINDOW 0 0 56 VBottom 2
SYMATTR Value 5000
SYMATTR InstName R47
SYMBOL cap 3120 1840 R0
WINDOW 3 41 47 Left 2
WINDOW 0 -20 -20 Left 2
SYMATTR Value 144fF
SYMATTR InstName Cmbit23
SYMBOL res 2752 1760 R90
WINDOW 3 32 56 VTop 2
WINDOW 0 0 56 VBottom 2
SYMATTR Value 100
SYMATTR InstName R48
SYMBOL res 2016 1248 R90
WINDOW 3 32 56 VTop 2
WINDOW 0 0 56 VBottom 2
SYMATTR Value 5000
SYMATTR InstName R49
SYMBOL res 2224 1248 R90
WINDOW 3 32 56 VTop 2
WINDOW 0 0 56 VBottom 2
SYMATTR Value 5000
SYMATTR InstName R50
SYMBOL cap 2048 1328 R0
WINDOW 3 41 47 Left 2
WINDOW 0 -20 -20 Left 2
SYMATTR Value 144fF
SYMATTR InstName Cmbit24
SYMBOL res 1680 1248 R90
WINDOW 3 32 56 VTop 2
WINDOW 0 0 56 VBottom 2
SYMATTR Value 100
SYMATTR InstName R51
TEXT -240 520 Left 2 !.include cmosedu_models.txt
TEXT -72 488 Left 2 !.ic v(bitline0)={vddhalf} v(bitline1)={vddhalf} v(mb0)={vdd} v(mb10)={vdd} v(mb22)={vdd}
TEXT -240 488 Left 2 !.tran 230ns uic
TEXT -240 776 Left 2 ;.param vdd=1.2V
TEXT -240 824 Left 2 ;.param vddhalf = 0.6V
TEXT -64 408 Left 4 ;Simulation Configuations
TEXT -232 664 Left 3 ;Looping through different Vdd values
TEXT -584 696 Left 2 ;// Select a few volts only
TEXT -488 1056 Left 2 ;.param tw= 1um
TEXT -480 952 Left 2 ;.param vdd=1.2V
TEXT -480 1000 Left 2 ;.param vddhalf=0.6V
TEXT -464 1104 Left 2 ;.param ntw=1um
TEXT -232 872 Left 2 !.param tw=2um
TEXT 0 864 Left 2 !.param ntw = 1um
TEXT 232 944 Left 2 !.param pretw=2um
TEXT 232 992 Left 2 !.param prentw=1um
TEXT -280 1240 Left 2 !.param vdd=1.2V
TEXT -280 1288 Left 2 !.param vddhalf=0.6V

The netlist it stands for:
* diva-dram_wordline.asc
VDD VDD 0 {vdd}
VDDby2 VDDby2 0 {vddhalf}
Vsp sense_P 0 PWL(15n {vdd} 15.5n 0 40n 0 40.5n {vdd}) Rser=100 Cpar=10fF
Vra0 ra0 0 PWL(10n 0 10.5n 3 35n 3.0 37.5n 0) Rser=2048 Cpar=0.6pF
Vsn sense_N 0 PWL(15n 0 15.5n {vdd} 40n {vdd} 40.5n 0) Rser=100 Cpar=10fF
Veq1 EqNot 0 PWL(0n 0 10.0n 0 10.5n {vdd} 40n {vdd} 40.5n 0)
Veq2 Eq 0 PWL(0n 1.5 10.0n 1.5 10.5n 0 40n 0 40.5n {vdd})
M15 bitline1 bitline0 N010 VDD pmos45hp l=0.16um w={tw}
R9 N010 ACT1 25000
M16 bitline0 bitline1 N010 VDD pmos45hp l=0.16um w={tw}
M17 bitline1 bitline0 N011 0 nmos45hp l=0.16um w={ntw}
M18 bitline0 bitline1 N011 0 nmos45hp l=0.16um w={ntw}
R10 N012 N011 25000
M19 bitline1 Eq01 bitline0 0 nmos45hp l=0.5um w={prentw}
M20 bitline0 Eq01 VDDby2 0 nmos45hp l=0.5um w={prentw}
M21 bitline1 Eq01 VDDby2 0 nmos45hp l=0.5um w={prentw}
M22 bitline0 EqNot01 VDDby2 VDD pmos45hp l=0.5um w={pretw}
M23 bitline1 EqNot01 VDDby2 VDD pmos45hp l=0.5um w={pretw}
M24 N012 sense_N01 0 0 nmos45lp l=0.27um w=0.22um
M25 ACT1 sense_p01 VDD VDD pmos45lp l=0.27um w=0.22um
M1 N013 ra01 mb0 0 nmos45lp l=0.085um w=0.055um
Cmbit0 mb0 0 24fF
R1 N013 BL0 1000
R2 N001 N002 5000
R3 BL0 N001 5000
Cmbit4 N001 0 72fF
M2 N014 ra1 mb1 0 nmos45lp l=0.085um w=0.055um
Cmbit1 mb1 0 24fF
R4 N014 N002 1000
R6 N003 N004 5000
R7 N002 N003 5000
Cmbit3 N003 0 72fF
M3 N015 ra2 mb2 0 nmos45lp l=0.085um w=0.055um
Cmbit5 mb2 0 24fF
R8 N015 N004 1000
R13 N004 bitline1 100
M4 N018 ra5 mb5 0 nmos45lp l=0.085um w=0.055um
Cmbit2 mb5 0 24fF
R5 N018 N009 1000
R11 N008 N007 5000
R12 N009 N008 5000
Cmbit6 N008 0 72fF
M5 N017 ra4 mb4 0 nmos45lp l=0.085um w=0.055um
Cmbit7 mb4 0 24fF
R14 N017 N007 1000
R15 N006 N005 5000
R16 N007 N006 5000
Cmbit8 N006 0 72fF
M6 N016 ra3 mb3 0 nmos45lp l=0.085um w=0.055um
Cmbit9 mb3 0 24fF
R17 N016 N005 1000
R18 N005 bitline0 100
M7 bitline11 bitline10 N028 VDD pmos45hp l=0.16um w={tw}
R19 N028 ACT2 25000
M8 bitline10 bitline11 N028 VDD pmos45hp l=0.16um w={tw}
M9 bitline11 bitline10 N029 0 nmos45hp l=0.16um w={ntw}
M10 bitline10 bitline11 N029 0 nmos45hp l=0.16um w={ntw}
R20 N030 N029 25000
M11 bitline11 Eq00 bitline10 0 nmos45hp l=0.5um w={prentw}
M12 bitline10 Eq00 VDDby2 0 nmos45hp l=0.5um w={prentw}
M13 bitline11 Eq00 VDDby2 0 nmos45hp l=0.5um w={prentw}
M14 bitline10 EqNot00 VDDby2 VDD pmos45hp l=0.5um w={pretw}
M26 bitline11 EqNot00 VDDby2 VDD pmos45hp l=0.5um w={pretw}
M27 N030 sense_N00 0 0 nmos45lp l=0.27um w=0.22um
M28 ACT2 sense_p00 VDD VDD pmos45lp l=0.27um w=0.22um
M29 N031 ra00 mb10 0 nmos45lp l=0.085um w=0.055um
Cmbit10 mb10 0 24fF
R21 N031 BL10 1000
R22 N019 N020 5000
R23 BL10 N019 5000
Cmbit11 N019 0 72fF
M30 N032 ra1 mb11 0 nmos45lp l=0.085um w=0.055um
Cmbit12 mb11 0 24fF
R24 N032 N020 1000
R25 N021 N022 5000
R26 N020 N021 5000
Cmbit13 N021 0 72fF
M31 N033 ra2 mb12 0 nmos45lp l=0.085um w=0.055um
Cmbit14 mb12 0 24fF
R27 N033 N022 1000
R28 N022 bitline11 100
M32 N036 ra5 mb15 0 nmos45lp l=0.085um w=0.055um
Cmbit15 mb15 0 24fF
R29 N036 N027 1000
R30 N026 N025 5000
R31 N027 N026 5000
Cmbit16 N026 0 72fF
M33 N035 ra4 mb14 0 nmos45lp l=0.085um w=0.055um
Cmbit17 mb14 0 24fF
R32 N035 N025 1000
R33 N024 N023 5000
R34 N025 N024 5000
Cmbit18 N024 0 72fF
M34 N034 ra3 mb13 0 nmos45lp l=0.085um w=0.055um
Cmbit19 mb13 0 24fF
R35 N034 N023 1000
R36 N023 bitline10 100
R40 N038 sense_p00 5000
R41 sense_p01 N038 5000
Cmbit22 N038 0 144fF
R43 sense_p00 sense_P 100
R37 N039 sense_N00 5000
R38 sense_N01 N039 5000
Cmbit20 N039 0 144fF
R39 sense_N00 sense_N 100
R42 N040 Eq00 5000
R44 Eq01 N040 5000
Cmbit21 N040 0 144fF
R45 Eq00 Eq 100
R46 N041 EqNot00 5000
R47 EqNot01 N041 5000
Cmbit23 N041 0 144fF
R48 EqNot00 EqNot 100
R49 N037 ra00 5000
R50 ra01 N037 5000
Cmbit24 N037 0 144fF
R51 ra00 ra0 100
.model NMOS NMOS
.model PMOS PMOS
.lib standard.mos
.include cmosedu_models.txt
.ic v(bitline0)={vddhalf} v(bitline1)={vddhalf} v(mb0)={vdd} v(mb10)={vdd} v(mb22)={vdd}
.tran 230ns uic
* .param vdd=1.2V
* .param vddhalf = 0.6V
* Simulation Configuations
* Looping through different Vdd values
* // Select a few volts only
* .param tw= 1um
* .param vdd=1.2V
* .param vddhalf=0.6V
* .param ntw=1um
.param tw=2um
.param ntw = 1um
.param pretw=2um
.param prentw=1um
.param vdd=1.2V
.param vddhalf=0.6V
.backanno
.end